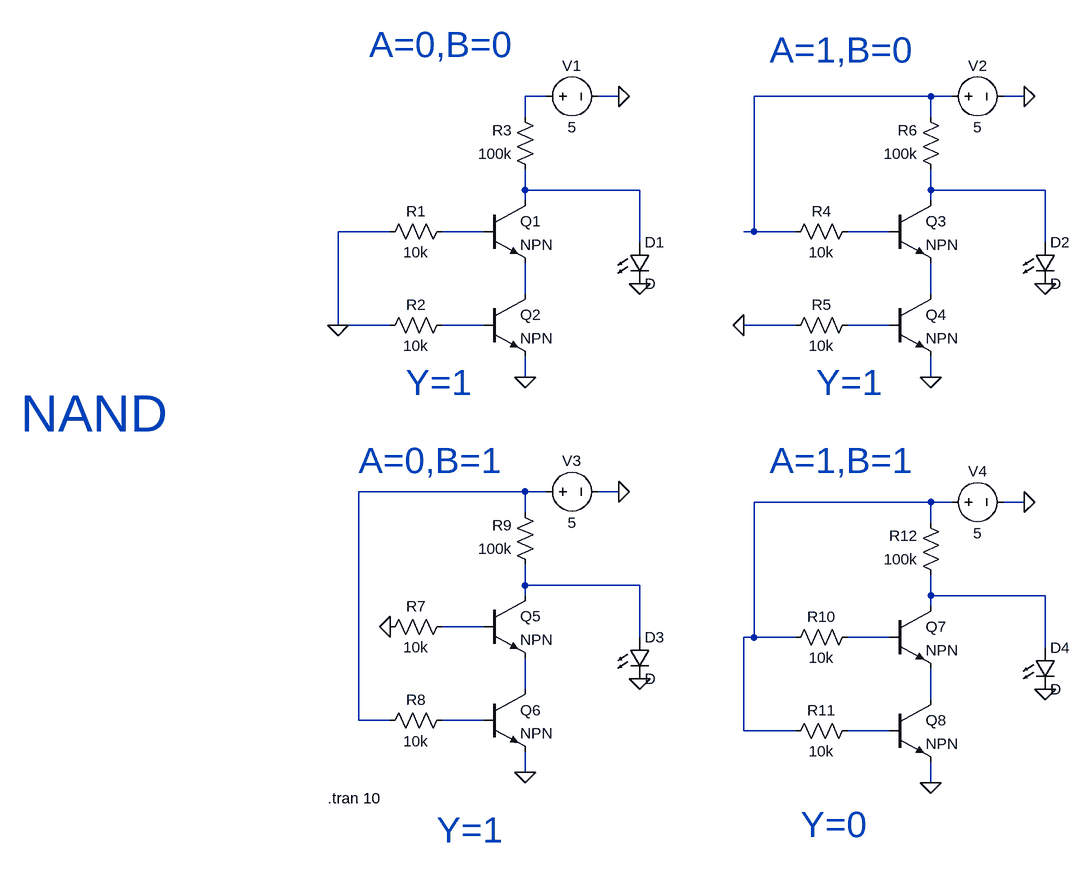
[diagram p0: schematic NandGate.asc]
NandGate.asc, the LTspice schematic file:
Version 4.1
SHEET 1 1052 1068
WIRE 224 -96 192 -96
WIRE 336 -96 304 -96
WIRE 816 -96 544 -96
WIRE 848 -96 816 -96
WIRE 960 -96 928 -96
WIRE 192 -64 192 -96
WIRE 816 -64 816 -96
WIRE 192 48 192 16
WIRE 368 48 192 48
WIRE 816 48 816 16
WIRE 992 48 816 48
WIRE 192 64 192 48
WIRE 816 64 816 48
WIRE -16 112 -96 112
WIRE 128 112 64 112
WIRE 544 112 544 -96
WIRE 544 112 528 112
WIRE 608 112 544 112
WIRE 752 112 688 112
WIRE 368 128 368 48
WIRE 992 128 992 48
WIRE 192 208 192 160
WIRE 816 208 816 160
WIRE -96 256 -96 112
WIRE -16 256 -96 256
WIRE 128 256 64 256
WIRE 608 256 528 256
WIRE 752 256 688 256
WIRE 192 336 192 304
WIRE 816 336 816 304
WIRE 192 512 -64 512
WIRE 224 512 192 512
WIRE 336 512 304 512
WIRE 816 528 544 528
WIRE 848 528 816 528
WIRE 960 528 928 528
WIRE 192 544 192 512
WIRE 816 560 816 528
WIRE 192 656 192 624
WIRE 368 656 192 656
WIRE 192 672 192 656
WIRE 816 672 816 640
WIRE 992 672 816 672
WIRE 816 688 816 672
WIRE 128 720 64 720
WIRE 368 736 368 656
WIRE 544 736 544 528
WIRE 544 736 528 736
WIRE 608 736 544 736
WIRE 752 736 688 736
WIRE 992 752 992 672
WIRE 192 816 192 768
WIRE 816 832 816 784
WIRE -64 864 -64 512
WIRE -16 864 -64 864
WIRE 128 864 64 864
WIRE 528 880 528 736
WIRE 608 880 528 880
WIRE 752 880 688 880
WIRE 192 944 192 912
WIRE 816 960 816 928
FLAG 368 192 0
FLAG 192 336 0
FLAG 336 -96 0
FLAG 992 192 0
FLAG 816 336 0
FLAG 960 -96 0
FLAG 368 800 0
FLAG 192 944 0
FLAG 336 512 0
FLAG 992 816 0
FLAG 816 960 0
FLAG 960 528 0
FLAG -96 256 0
FLAG 528 256 0
FLAG -16 720 0
SYMBOL npn 128 64 R0
SYMATTR InstName Q1
SYMBOL npn 128 208 R0
SYMATTR InstName Q2
SYMBOL res 80 96 R90
WINDOW 0 0 56 VBottom 2
WINDOW 3 32 56 VTop 2
SYMATTR InstName R1
SYMATTR Value 10k
SYMBOL res 80 240 R90
WINDOW 0 0 56 VBottom 2
WINDOW 3 32 56 VTop 2
SYMATTR InstName R2
SYMATTR Value 10k
SYMBOL res 208 32 R180
WINDOW 0 36 76 Left 2
WINDOW 3 36 40 Left 2
SYMATTR InstName R3
SYMATTR Value 100k
SYMBOL LED 352 128 R0
SYMATTR InstName D1
SYMBOL voltage 208 -96 R270
WINDOW 0 32 56 VTop 2
WINDOW 3 -32 56 VBottom 2
WINDOW 123 0 0 Left 0
WINDOW 39 0 0 Left 0
SYMATTR InstName V1
SYMATTR Value 5
SYMBOL npn 752 64 R0
SYMATTR InstName Q3
SYMBOL npn 752 208 R0
SYMATTR InstName Q4
SYMBOL res 704 96 R90
WINDOW 0 0 56 VBottom 2
WINDOW 3 32 56 VTop 2
SYMATTR InstName R4
SYMATTR Value 10k
SYMBOL res 704 240 R90
WINDOW 0 0 56 VBottom 2
WINDOW 3 32 56 VTop 2
SYMATTR InstName R5
SYMATTR Value 10k
SYMBOL res 832 32 R180
WINDOW 0 36 76 Left 2
WINDOW 3 36 40 Left 2
SYMATTR InstName R6
SYMATTR Value 100k
SYMBOL LED 976 128 R0
SYMATTR InstName D2
SYMBOL voltage 832 -96 R270
WINDOW 0 32 56 VTop 2
WINDOW 3 -32 56 VBottom 2
WINDOW 123 0 0 Left 0
WINDOW 39 0 0 Left 0
SYMATTR InstName V2
SYMATTR Value 5
SYMBOL npn 128 672 R0
SYMATTR InstName Q5
SYMBOL npn 128 816 R0
SYMATTR InstName Q6
SYMBOL res 80 704 R90
WINDOW 0 0 56 VBottom 2
WINDOW 3 32 56 VTop 2
SYMATTR InstName R7
SYMATTR Value 10k
SYMBOL res 80 848 R90
WINDOW 0 0 56 VBottom 2
WINDOW 3 32 56 VTop 2
SYMATTR InstName R8
SYMATTR Value 10k
SYMBOL res 208 640 R180
WINDOW 0 36 76 Left 2
WINDOW 3 36 40 Left 2
SYMATTR InstName R9
SYMATTR Value 100k
SYMBOL LED 352 736 R0
SYMATTR InstName D3
SYMBOL voltage 208 512 R270
WINDOW 0 32 56 VTop 2
WINDOW 3 -32 56 VBottom 2
WINDOW 123 0 0 Left 0
WINDOW 39 0 0 Left 0
SYMATTR InstName V3
SYMATTR Value 5
SYMBOL npn 752 688 R0
SYMATTR InstName Q7
SYMBOL npn 752 832 R0
SYMATTR InstName Q8
SYMBOL res 704 720 R90
WINDOW 0 0 56 VBottom 2
WINDOW 3 32 56 VTop 2
SYMATTR InstName R10
SYMATTR Value 10k
SYMBOL res 704 864 R90
WINDOW 0 0 56 VBottom 2
WINDOW 3 32 56 VTop 2
SYMATTR InstName R11
SYMATTR Value 10k
SYMBOL res 832 656 R180
WINDOW 0 36 76 Left 2
WINDOW 3 36 40 Left 2
SYMATTR InstName R12
SYMATTR Value 100k
SYMBOL LED 976 752 R0
SYMATTR InstName D4
SYMBOL voltage 832 528 R270
WINDOW 0 32 56 VTop 2
WINDOW 3 -32 56 VBottom 2
WINDOW 123 0 0 Left 0
WINDOW 39 0 0 Left 0
SYMATTR InstName V4
SYMATTR Value 5
TEXT -48 -176 Left 5 ;A=0,B=0
TEXT 568 -168 Left 5 ;A=1,B=0
TEXT -64 464 Left 5 ;A=0,B=1
TEXT 568 464 Left 5 ;A=1,B=1
TEXT -112 984 Left 2 !.tran 10
TEXT 8 344 Left 5 ;Y=1
TEXT 640 344 Left 5 ;Y=1
TEXT 56 1032 Left 5 ;Y=1
TEXT 616 1024 Left 5 ;Y=0
TEXT -584 392 Left 6 ;NAND

The netlist it stands for:
* NandGate.asc
Q1 N003 N005 N007 0 NPN
Q2 N007 N009 0 0 NPN
R1 N005 0 10k
R2 N009 0 10k
R3 N003 N001 100k
D1 N003 0 D
V1 N001 0 5
Q3 N004 N006 N008 0 NPN
Q4 N008 N010 0 0 NPN
R4 N006 N002 10k
R5 N010 0 10k
R6 N004 N002 100k
D2 N004 0 D
V2 N002 0 5
Q5 N013 N015 N017 0 NPN
Q6 N017 N019 0 0 NPN
R7 N015 0 10k
R8 N019 N011 10k
R9 N013 N011 100k
D3 N013 0 D
V3 N011 0 5
Q7 N014 N016 N018 0 NPN
Q8 N018 N020 0 0 NPN
R10 N016 N012 10k
R11 N020 N012 10k
R12 N014 N012 100k
D4 N014 0 D
V4 N012 0 5
.model D D
.lib standard.dio
.model NPN NPN
.model PNP PNP
.lib standard.bjt
* A=0,B=0
* A=1,B=0
* A=0,B=1
* A=1,B=1
.tran 10
* Y=1
* Y=1
* Y=1
* Y=0
* NAND
.backanno
.end